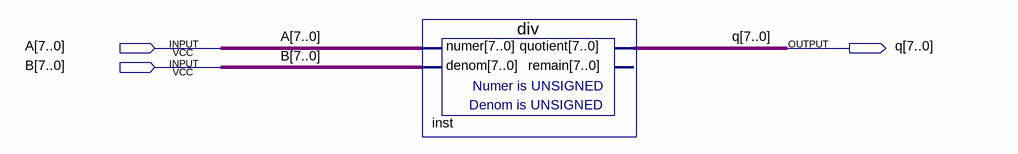
[diagram p0: schematic sheet]
// Quartus schematic divv.bdf as structural Verilog: 1 symbols, 3 pins
module divv (
  input  [7:0] A,
  input  [7:0] B,
  output [7:0] q
);

  div inst (.numer(A), .denom(B), .quotient(q));  // open: remain
endmodule
